# Altium schematic sheet 单相.SchDoc
size A4
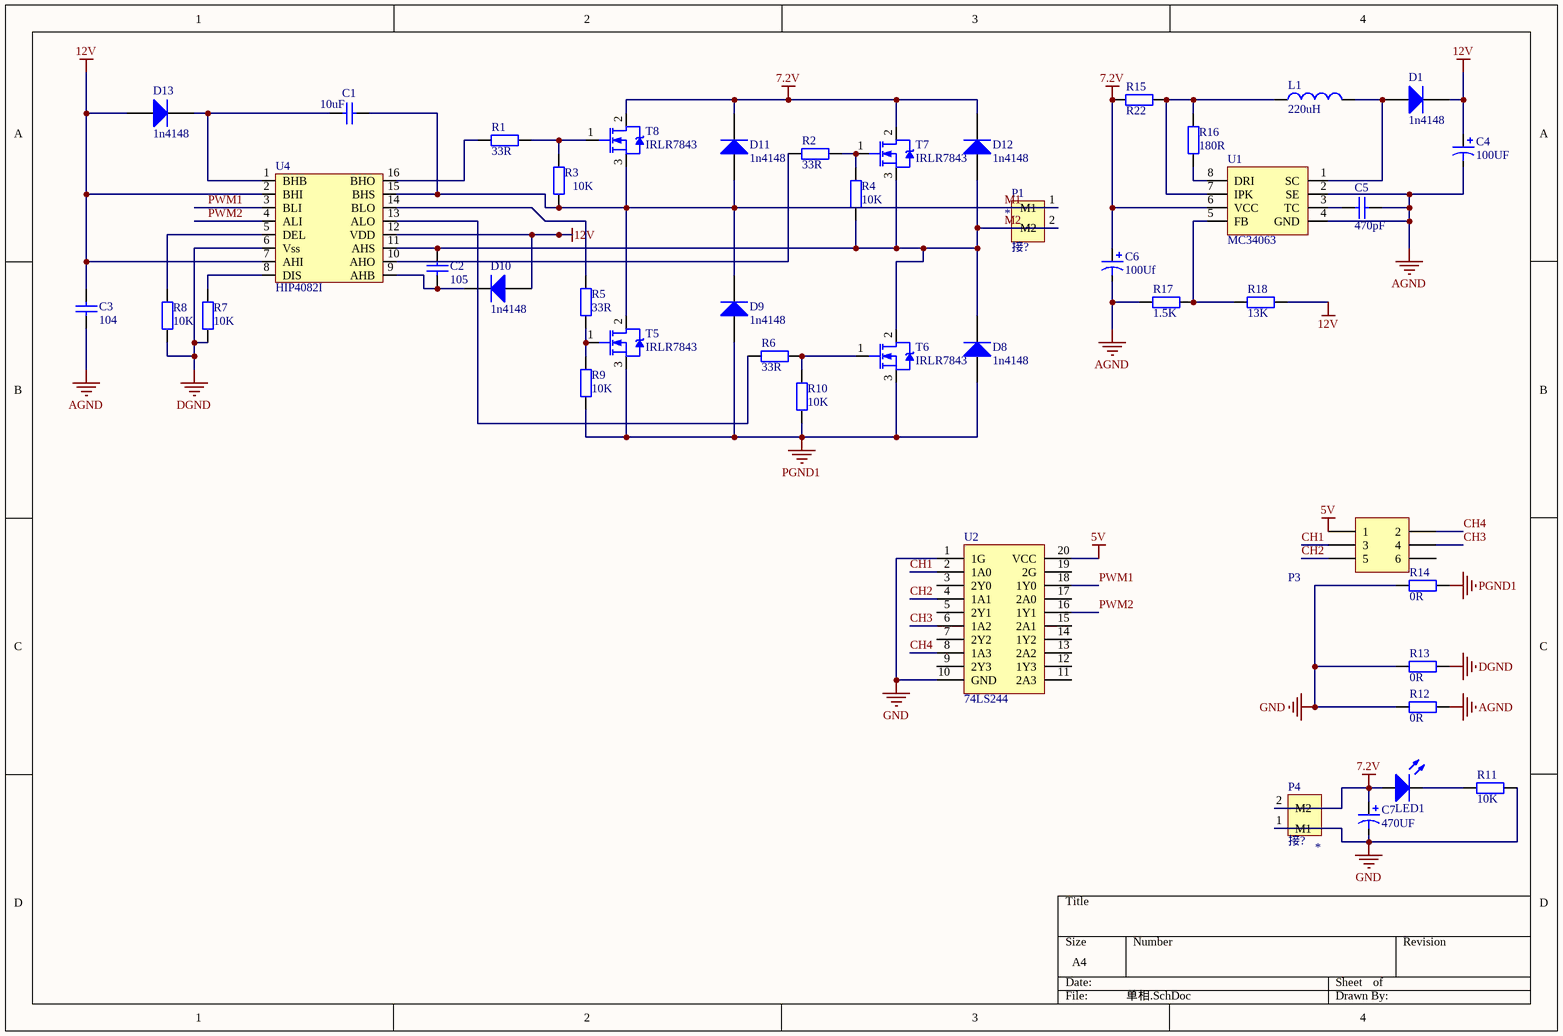
[diagram p0: 单相.SchDoc]

## Parts
C1  value 10uF  [0805]  (hidden comment: 105)
C2  105  [0805]
C3  104  [0805]
C4  100UF  [ED6.3]
C5  470pF  [0805]
C6  100Uf  [ED6.3]
C7  470UF  [ED8]
D1  1n4148  [二极管]
D8  1n4148  [二极管]
D9  1n4148  [二极管]
D10  1n4148  [二极管]
D11  1n4148  [二极管]
D12  1n4148  [二极管]
D13  1n4148  [二极管]
L1  220uH  [电感（220uh）]
LED1  LED  [LED(0805)]  (value not drawn)
P1  *  [接线端子]
P3  Header 3X2  [HDR2X3]  (value not drawn)
P4  *  [接线端子]
R1  33R  [0805]
R2  33R  [0805]
R3  10K  [0805]
R4  10K  [0805]
R5  33R  [0805]
R6  33R  [0805]
R7  10K  [0805]
R8  10K  [0805]
R9  10K  [0805]
R10  10K  [0805]
R11  10K  [0603]
R12  0R  [0805]
R13  0R  [0805]
R14  0R  [0805]
R15  R22  [0805]
R16  180R  [0805]
R17  1.5K  [0805]
R18  13K  [0805]
T5  IRLR7843  [IRLR7843(MOS)]
T6  IRLR7843  [IRLR7843(MOS)]
T7  IRLR7843  [IRLR7843(MOS)]
T8  IRLR7843  [IRLR7843(MOS)]
U1  MC34063  [MA34063]
U2  74LS244  [74LS244D]
U4  HIP4082I  [HIP4082I]

## Nets
5V: P3.1 U2.20(VCC)
7.2V: C6.1 C7.1 D11.2(K) D12.2(K) LED1.1(A) P4.2(M2) R15.1 T7.2(D) T8.2(D) U1.6(VCC)
12V: C3.2 C4.1 D1.2(K) D10.1(A) D13.1(A) R18.2 U4.2(BHI) U4.7(AHI) U4.12(VDD)
AGND: C3.1 C4.2 C5.1 C6.2 R12.2 R17.1 U1.2(SE) U1.4(GND)
DGND: R7.1 R8.1 R13.2 U4.6(Vss)
GND: C7.2 P4.1(M1) R11.1 R12.1 R13.1 R14.1 U2.1(1G) U2.10(GND)
PGND1: D8.1(A) D9.1(A) R9.2 R10.1 R14.2 T5.3(S) T6.3(S)
CH1: P3.3 U2.2(1A0)
CH2: P3.5 U2.4(1A1)
CH3: P3.4 U2.6(1A2)
CH4: P3.2 U2.8(1A3)
M1: C1.2 D9.2(K) D11.1(A) P1.1(M1) R3.2 T5.2(D) T8.3(S) U4.15(BHS)
M2: C2.2 D8.2(K) D12.1(A) P1.2(M2) R4.2 T6.2(D) T7.3(S) U4.11(AHS)
PWM1: U2.18(1Y0) U4.3(BLI)
PWM2: U2.16(1Y1) U4.4(ALI)
NetC1_1: C1.1 D13.2(K) U4.1(BHB)
NetC2_1: C2.1 D10.2(K) U4.9(AHB)
NetC5_2: C5.2 U1.3(TC)
NetD1_1: D1.1(A) L1.2 U1.1(SC)
NetL1_1: L1.1 R15.2 R16.2 U1.7(IPK)
NetLED1_2: LED1.2(K) R11.2
NetR1_1: R1.1 U4.16(BHO)
NetR1_2: R1.2 R3.1 T8.1(G)
NetR2_1: R2.1 R4.1 T7.1(G)
NetR2_2: R2.2 U4.10(AHO)
NetR5_1: R5.1 R9.1 T5.1(G)
NetR5_2: R5.2 U4.14(BLO)
NetR6_1: R6.1 R10.2 T6.1(G)
NetR6_2: R6.2 U4.13(ALO)
NetR7_2: R7.2 U4.8(DIS)
NetR8_2: R8.2 U4.5(DEL)
NetR16_1: R16.1 U1.8(DRI)
NetR17_2: R17.2 R18.1 U1.5(FB)

Not connected (* = marked no-connect by the designer): P3 6; U2 3(2Y0) 5(2Y1) 7(2Y2) 9(2Y3) 11(2A3) 12(1Y3) 13(2A2) 14(1Y2) 15(2A1) 17(2A0) 19(2G)

## Notes on the sheet
- (in symbol 接线端子) 接?

## Library data of the parts
C1 = Cap: 无极电容
C2 C3 C5 = Cap: 无极电容; Value: 10uF
C4 C6 C7 = pol cap: 通用有极电容; value: 22uF
L1 = 电感 220uh: 7*7*4; Value: 220uH
LED1 = LED: 发光二极管
P1 P4 = 接线端子
P3 = Header 3X2: Header, 3-Pin, Dual row; LatestRevisionDate: 17-Jul-2002; LatestRevisionNote: Re-released for DXP Platform.; Publisher: Altium Limited
R1 R2 R5 R6 R12-R18 = Res: 通用电阻; Value: 10K
R3 R4 R7-R11 = Res: 通用电阻; Value: 10K
T5-T8 = N_MOS(I